# Altium schematic sheet Flash.SchDoc
size B
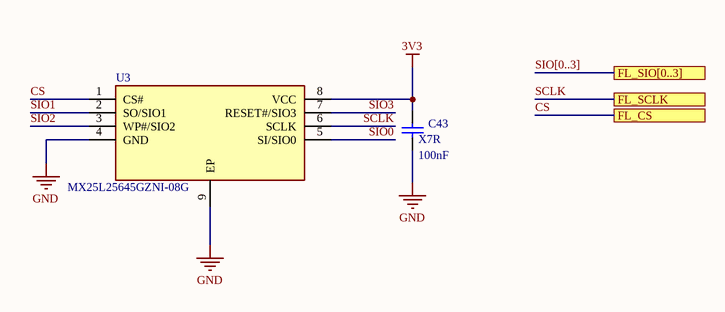
[diagram p0: Flash.SchDoc]

## Parts
C43  X7R  value 100nF  [1608[0603]]
U3  MX25L25645GZNI-08G  [SON127P600X500X80-9N-D]

## Ports
FL_CS, FL_SCLK, FL_SIO[0..3]

## Nets
3V3: C43.2 U3.8(VCC)
GND: C43.1 U3.4(GND) U3.9(EP)
CS: U3.1(CS#) ; port FL_CS
SCLK: U3.6(SCLK) ; port FL_SCLK
SIO0: U3.5(SI/SIO0)
SIO1: U3.2(SO/SIO1)
SIO2: U3.3(WP#/SIO2)
SIO3: U3.7(RESET#/SIO3)

## Buses and harness runs
bus SIO[0..3] = port FL_SIO[0..3]

## Library data of the parts
C43 = Cap: Capacitor; Published: 8-Jun-2000; LatestRevisionDate: 17-Jul-2002; LatestRevisionNote: Re-released for DXP Platform.; PackageReference: RAD-0.3; Publisher: Altium Limited; PackageDescription: Radial Cap, Thru-Hole; 2 Leads; 0.3 in Pin Spacing
U3 = MX25L25645GZNI-08G: Integrated Circuit; Manufacturer_Name: Macronix; Datasheet Link: https://www.macronix.com/Lists/Datasheet/Attachments/7858/MX25L25645G,%203V,%20256Mb,%20v1.9.pdf; Height: 0.8mm; Manufacturer_Part_Number: MX25L25645GZNI-08G; Arrow Part Number: MX25L25645GZNI-08G; Arrow Price/Stock: https://www.arrow.com/en/products/mx25l25645gzni-08g/macronix-international?region=nac